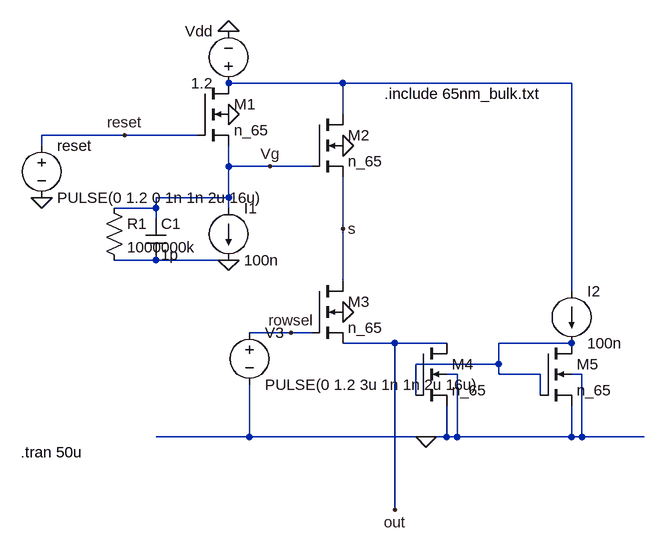
[diagram p0: schematic T3_APS.asc]
T3_APS.asc, the LTspice schematic file:
Version 4.1
SHEET 1 880 788
WIRE 240 48 64 48
WIRE 592 48 240 48
WIRE 240 96 240 48
WIRE -96 128 -224 128
WIRE 16 128 -96 128
WIRE -224 144 -224 128
WIRE 64 176 64 144
WIRE 128 176 64 176
WIRE 192 176 128 176
WIRE 64 224 64 176
WIRE 64 224 -48 224
WIRE -48 240 -48 224
WIRE -48 240 -112 240
WIRE 64 240 64 224
WIRE -48 256 -48 240
WIRE 240 272 240 192
WIRE -48 320 -112 320
WIRE 64 320 -48 320
WIRE 240 352 240 272
WIRE 592 368 592 48
WIRE 160 432 96 432
WIRE 192 432 160 432
WIRE 320 448 240 448
WIRE 400 448 320 448
WIRE 592 448 480 448
WIRE 480 480 480 448
WIRE 480 480 352 480
WIRE 416 496 400 496
WIRE 480 496 480 480
WIRE 544 496 480 496
WIRE 608 496 592 496
WIRE 352 528 352 480
WIRE 544 528 544 496
WIRE 96 592 96 512
WIRE 96 592 -48 592
WIRE 368 592 96 592
WIRE 400 592 400 544
WIRE 400 592 368 592
WIRE 416 592 416 496
WIRE 416 592 400 592
WIRE 592 592 592 544
WIRE 592 592 416 592
WIRE 608 592 608 496
WIRE 608 592 592 592
WIRE 704 592 608 592
WIRE 320 704 320 448
FLAG 64 96 0
FLAG -224 224 0
FLAG 64 320 0
FLAG 368 592 0
FLAG 240 144 0
FLAG 240 400 0
FLAG 64 -32 0
FLAG 128 176 Vg
FLAG -96 128 reset
FLAG 160 432 rowsel
FLAG 240 272 s
FLAG 320 704 out
SYMBOL nmos4 16 48 R0
SYMATTR InstName M1
SYMATTR Value n_65
SYMATTR Value2 l=65n w=1u
SYMBOL voltage 64 64 R180
WINDOW 0 24 96 Left 2
WINDOW 3 24 16 Left 2
WINDOW 123 0 0 Left 0
WINDOW 39 0 0 Left 0
SYMATTR InstName Vdd
SYMATTR Value 1.2
SYMBOL voltage -224 128 R0
WINDOW 123 0 0 Left 0
WINDOW 39 0 0 Left 0
SYMATTR InstName reset
SYMATTR Value PULSE(0 1.2 0 1n 1n 2u 16u)
SYMBOL current 64 240 R0
WINDOW 123 0 0 Left 0
WINDOW 39 0 0 Left 0
SYMATTR InstName I1
SYMATTR Value 100n
SYMBOL cap -64 256 R0
SYMATTR InstName C1
SYMATTR Value 1p
SYMBOL res -128 224 R0
SYMATTR InstName R1
SYMATTR Value 1000000k
SYMBOL nmos4 192 96 R0
SYMATTR InstName M2
SYMATTR Value n_65
SYMATTR Value2 l=65n w=1u
SYMBOL nmos4 192 352 R0
SYMATTR InstName M3
SYMATTR Value n_65
SYMATTR Value2 l=65n w=1u
SYMBOL voltage 96 416 R0
WINDOW 123 0 0 Left 0
WINDOW 39 0 0 Left 0
SYMATTR InstName V3
SYMATTR Value PULSE(0 1.2 3u 1n 1n 2u 16u)
SYMBOL nmos4 352 448 R0
SYMATTR InstName M4
SYMATTR Value n_65
SYMATTR Value2 l=65n w=1u
SYMBOL nmos4 544 448 R0
SYMATTR InstName M5
SYMATTR Value n_65
SYMATTR Value2 l=65n w=1u
SYMBOL current 592 368 R0
WINDOW 123 0 0 Left 0
WINDOW 39 0 0 Left 0
SYMATTR InstName I2
SYMATTR Value 100n
TEXT 304 64 Left 2 !.include 65nm_bulk.txt
TEXT -256 616 Left 2 !.tran 50u

The netlist it stands for:
* T3_APS.asc
M1 N001 reset Vg 0 n_65 l=65n w=1u
Vdd N001 0 1.2
V§reset reset 0 PULSE(0 1.2 0 1n 1n 2u 16u)
I1 Vg 0 100n
C1 Vg 0 1p
R1 Vg 0 1000000k
M2 N001 Vg s 0 n_65 l=65n w=1u
M3 s rowsel out 0 n_65 l=65n w=1u
V3 rowsel 0 PULSE(0 1.2 3u 1n 1n 2u 16u)
M4 out N002 0 0 n_65 l=65n w=1u
M5 N002 N002 0 0 n_65 l=65n w=1u
I2 N001 N002 100n
.model NMOS NMOS
.model PMOS PMOS
.lib standard.mos
.include 65nm_bulk.txt
.tran 50u
.backanno
.end